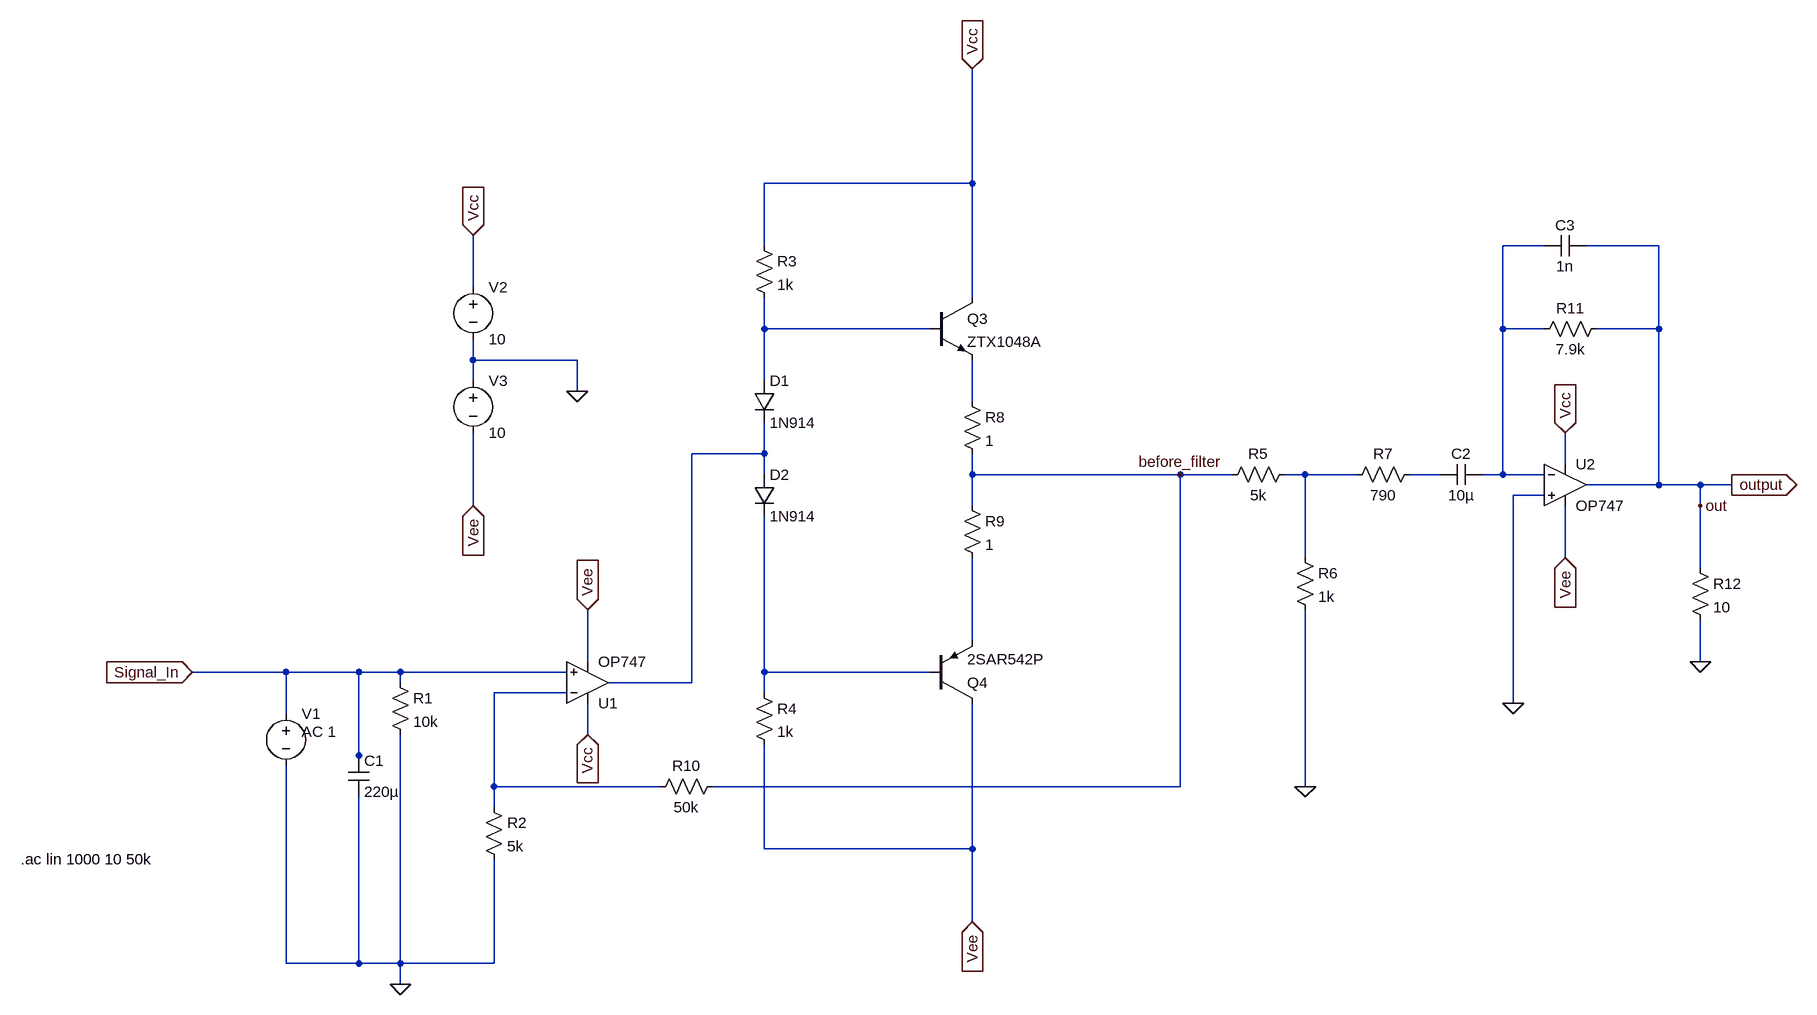
[diagram p0: schematic Amplifier circuit.asc]
Amplifier circuit.asc, the LTspice schematic file:
Version 4
SHEET 1 2964 720
WIRE 1072 -624 1072 -800
WIRE 1072 -624 752 -624
WIRE 752 -528 752 -624
WIRE 1952 -528 1888 -528
WIRE 2128 -528 2016 -528
WIRE 304 -464 304 -544
WIRE 1072 -448 1072 -624
WIRE 752 -400 752 -448
WIRE 1008 -400 752 -400
WIRE 1888 -400 1888 -528
WIRE 1952 -400 1888 -400
WIRE 2128 -400 2128 -528
WIRE 2128 -400 2032 -400
WIRE 304 -352 304 -384
WIRE 464 -352 304 -352
WIRE 304 -320 304 -352
WIRE 752 -320 752 -400
WIRE 464 -304 464 -352
WIRE 1072 -288 1072 -352
WIRE 752 -208 752 -256
WIRE 752 -208 640 -208
WIRE 1984 -192 1984 -240
WIRE 752 -176 752 -208
WIRE 1072 -176 1072 -208
WIRE 1392 -176 1072 -176
WIRE 1472 -176 1392 -176
WIRE 1584 -176 1552 -176
WIRE 1664 -176 1584 -176
WIRE 1792 -176 1744 -176
WIRE 1888 -176 1888 -400
WIRE 1888 -176 1856 -176
WIRE 1952 -176 1888 -176
WIRE 2128 -160 2128 -400
WIRE 2128 -160 2016 -160
WIRE 2192 -160 2128 -160
WIRE 2240 -160 2192 -160
WIRE 1952 -144 1904 -144
WIRE 304 -128 304 -240
WIRE 1072 -128 1072 -176
WIRE 2192 -128 2192 -160
WIRE 1584 -48 1584 -176
WIRE 1984 -48 1984 -128
WIRE 2192 -32 2192 -128
WIRE 1072 80 1072 -48
WIRE 480 112 480 32
WIRE 2192 112 2192 48
WIRE 16 128 -128 128
WIRE 128 128 16 128
WIRE 192 128 128 128
WIRE 448 128 192 128
WIRE 752 128 752 -112
WIRE 1008 128 752 128
WIRE 192 144 192 128
WIRE 640 144 640 -208
WIRE 640 144 512 144
WIRE 448 160 336 160
WIRE 752 160 752 128
WIRE 1904 176 1904 -144
WIRE 16 192 16 128
WIRE 480 224 480 176
WIRE 128 256 128 128
WIRE 128 272 128 256
WIRE 336 304 336 160
WIRE 592 304 336 304
WIRE 1392 304 1392 -176
WIRE 1392 304 672 304
WIRE 1584 304 1584 32
WIRE 336 336 336 304
WIRE 752 400 752 240
WIRE 1072 400 1072 176
WIRE 1072 400 752 400
WIRE 1072 512 1072 400
WIRE 16 576 16 272
WIRE 128 576 128 320
WIRE 128 576 16 576
WIRE 192 576 192 224
WIRE 192 576 128 576
WIRE 336 576 336 416
WIRE 336 576 192 576
WIRE 192 608 192 576
FLAG -128 128 Signal_In
IOPIN -128 128 In
FLAG 192 608 0
FLAG 480 224 Vcc
IOPIN 480 224 In
FLAG 480 32 Vee
IOPIN 480 32 In
FLAG 1072 -800 Vcc
IOPIN 1072 -800 In
FLAG 464 -304 0
FLAG 304 -544 Vcc
IOPIN 304 -544 In
FLAG 304 -128 Vee
IOPIN 304 -128 In
FLAG 1072 512 Vee
IOPIN 1072 512 In
FLAG 1584 304 0
FLAG 1904 176 0
FLAG 1984 -240 Vcc
IOPIN 1984 -240 In
FLAG 1984 -48 Vee
IOPIN 1984 -48 In
FLAG 2240 -160 output
IOPIN 2240 -160 Out
FLAG 2192 112 0
FLAG 2192 -128 out
FLAG 1392 -176 before_filter
SYMBOL res 176 128 R0
SYMATTR InstName R1
SYMATTR Value 10k
SYMBOL res 320 320 R0
SYMATTR InstName R2
SYMATTR Value 5k
SYMBOL voltage 16 176 R0
WINDOW 3 -693 486 Left 2
WINDOW 123 24 44 Left 2
WINDOW 39 0 0 Left 2
SYMATTR Value ""
SYMATTR InstName V1
SYMATTR Value2 AC 1
SYMBOL npn 1008 -448 R0
SYMATTR InstName Q3
SYMATTR Value ZTX1048A
SYMBOL res 1056 -304 R0
SYMATTR InstName R8
SYMATTR Value 1
SYMBOL res 1056 -144 R0
SYMATTR InstName R9
SYMATTR Value 1
SYMBOL pnp 1008 176 M180
SYMATTR InstName Q4
SYMATTR Value 2SAR542P
SYMBOL res 688 288 R90
WINDOW 0 0 56 VBottom 2
WINDOW 3 32 56 VTop 2
SYMATTR InstName R10
SYMATTR Value 50k
SYMBOL voltage 304 -480 R0
WINDOW 123 0 0 Left 2
WINDOW 39 0 0 Left 2
SYMATTR InstName V2
SYMATTR Value 10
SYMBOL voltage 304 -336 R0
WINDOW 123 0 0 Left 2
WINDOW 39 0 0 Left 2
SYMATTR InstName V3
SYMATTR Value 10
SYMBOL Opamps\\OP747 480 208 M180
SYMATTR InstName U1
SYMBOL res 736 -544 R0
SYMATTR InstName R3
SYMATTR Value 1k
SYMBOL diode 736 -320 R0
SYMATTR InstName D1
SYMATTR Value 1N914
SYMBOL diode 736 -176 R0
SYMATTR InstName D2
SYMATTR Value 1N914
SYMBOL res 736 144 R0
SYMATTR InstName R4
SYMATTR Value 1k
SYMBOL res 1568 -192 R90
WINDOW 0 0 56 VBottom 2
WINDOW 3 32 56 VTop 2
SYMATTR InstName R5
SYMATTR Value 5k
SYMBOL res 1568 -64 R0
SYMATTR InstName R6
SYMATTR Value 1k
SYMBOL Opamps\\OP747 1984 -224 R0
SYMATTR InstName U2
SYMBOL res 1760 -192 R90
WINDOW 0 0 56 VBottom 2
WINDOW 3 32 56 VTop 2
SYMATTR InstName R7
SYMATTR Value 790
SYMBOL cap 1856 -192 R90
WINDOW 0 0 32 VBottom 2
WINDOW 3 32 32 VTop 2
SYMATTR InstName C2
SYMATTR Value 10µ
SYMBOL cap 2016 -544 R90
WINDOW 0 0 32 VBottom 2
WINDOW 3 32 32 VTop 2
SYMATTR InstName C3
SYMATTR Value 1n
SYMBOL res 2048 -416 R90
WINDOW 0 0 56 VBottom 2
WINDOW 3 32 56 VTop 2
SYMATTR InstName R11
SYMATTR Value 7.9k
SYMBOL res 2176 -48 R0
SYMATTR InstName R12
SYMATTR Value 10
SYMBOL cap 112 256 R0
SYMATTR InstName C1
SYMATTR Value 220µ
TEXT -392 416 Left 2 !.ac lin 1000 10 50k

The netlist it stands for:
* Amplifier circuit.asc
R1 Signal_In 0 10k
R2 N009 0 5k
V1 Signal_In 0 AC 1
Q3 Vcc N002 N003 0 ZTX1048A
R8 N003 before_filter 1
R9 before_filter N007 1
Q4 Vee N008 N007 0 2SAR542P
R10 before_filter N009 50k
V2 Vcc 0 10
V3 0 Vee 10
XU1 Signal_In N009 Vcc Vee N004 OP747  ; pins In+ In- V+ V- OUT
R3 Vcc N002 1k
D1 N002 N004 1N914
D2 N004 N008 1N914
R4 N008 Vee 1k
R5 N005 before_filter 5k
R6 N005 0 1k
XU2 0 N001 Vcc Vee out OP747  ; pins In+ In- V+ V- OUT
R7 N006 N005 790
C2 N001 N006 10µ
C3 out N001 1n
R11 out N001 7.9k
R12 out 0 10
C1 Signal_In 0 220µ
.model D D
.lib standard.dio
.model NPN NPN
.model PNP PNP
.lib standard.bjt
.ac lin 1000 10 50k
.backanno
.end